# EAGLE design untitled (EAGLE 5.08)
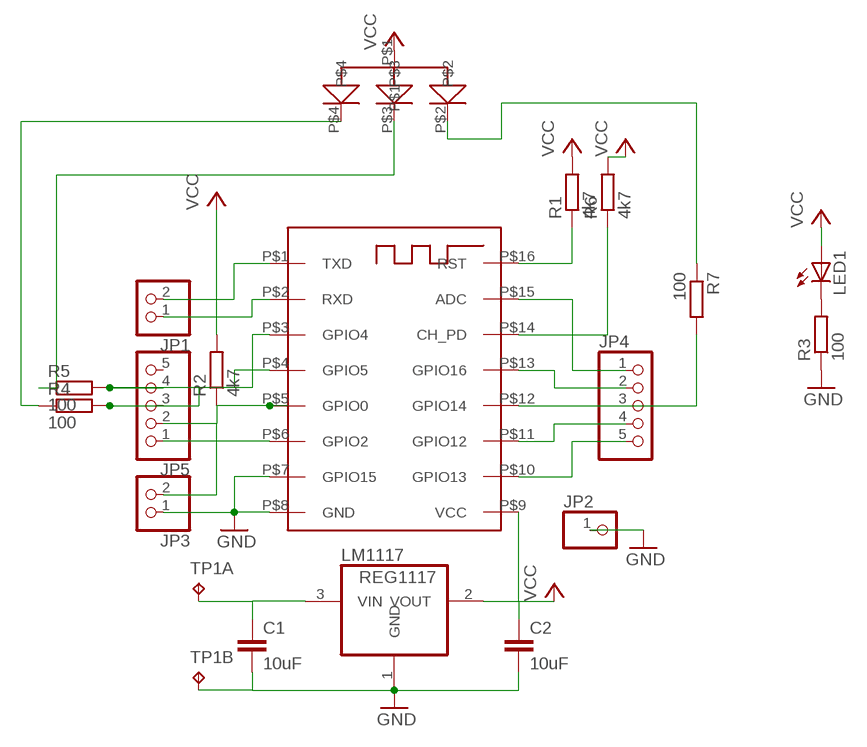
[diagram p0: schematic, sheet 1]

## Parts
C1  10uF  C-EUC0805K  [C0805K]
C2  10uF  C-EUC0805K  [C0805K]
ESP8266_07  ESP07  [ESP07]
JP1  PINHD-1X02_2.54-S  [1X02-S]
JP2  PINHD-1X1  [1X01]
JP3  PINHD-1X02_2.54-S  [1X02-S]
JP4  PINHD-1X05_2.54-S  [1X05-S]
JP5  PINHD-1X05_2.54-S  [1X05-S]
LED1  LEDCHIPLED_1206  [CHIPLED_1206]
LM1117  REG1117  [SOT223]
R1  4k7  R-EU_R0805  [R0805]
R2  4k7  R-EU_R0805  [R0805]
R3  100  R-EU_R0805  [R0805]
R4  100  R-EU_R0805  [R0805]
R5  100  R-EU_R0805  [R0805]
R6  4k7  R-EU_R0805  [R0805]
R7  100  R-EU_R0805  [R0805]
TP1  TP2P2-38-20  [P2-38-20]
U$1  LED  [LED]

## Nets
GND: C1.2 C2.2 ESP8266_07.P$7(GPIO15) ESP8266_07.P$8(GND) JP2.1 JP3.1 LM1117.1(GND) R3.1 TP1.TP-2
N$1: C1.1 LM1117.3(VIN) TP1.TP-1
N$2: ESP8266_07.P$14(CH_PD) R6.1
N$3: ESP8266_07.P$16(RST) R1.1
N$4: LED1.C R3.2
N$6: ESP8266_07.P$5(GPIO0) JP3.2 JP5.2 R2.1
N$7: ESP8266_07.P$1(TXD) JP1.2
N$8: R5.1 U$1.P$3
N$9: ESP8266_07.P$15(ADC) JP4.1
N$10: ESP8266_07.P$13(GPIO16) JP4.2
N$11: ESP8266_07.P$12(GPIO14) JP4.3 R7.2
N$12: ESP8266_07.P$11(GPIO12) JP4.4
N$13: ESP8266_07.P$10(GPIO13) JP4.5
N$14: ESP8266_07.P$2(RXD) JP1.1
N$15: ESP8266_07.P$6(GPIO2) JP5.1
N$16: ESP8266_07.P$4(GPIO5) JP5.3 R4.2
N$17: ESP8266_07.P$3(GPIO4) JP5.4 R5.2
N$18: R7.1 U$1.P$2
N$21: R4.1 U$1.P$4
VCC: C2.1 ESP8266_07.P$9(VCC) LED1.A LM1117.2(VOUT) R1.2 R2.2 R6.2 U$1.P$1
Unconnected: JP5.5

## Library data of the parts
C1 C2 = rcl:C-EU: CAPACITOR, European symbol
ESP8266_07 = connectors:ESP07
JP1 JP3 = pinhead-2:PINHD-1X02: PIN HEADER
JP2 = pinhead:PINHD-1X1: PIN HEADER
JP4 JP5 = pinhead-2:PINHD-1X05: PIN HEADER
LED1 = led:LED: LED OSRAM: - CHIPLED LG R971, LG N971, LY N971, LG Q971, LY Q971, LO R971, LY R971 LH N974, LH R974 LS Q976, LO Q976, LY Q976 LO Q996 - Hyper CHIPLED LW Q18S LB Q993, LB Q99A, LB R99A - SideLED LS A670, LO A670, LY A670, LG A670, LP A670 LB A673, LV A673, LT A673, LW A673 LH A674 LY A675 LS A676, LA A676, LO A676, LY A676, LW A676 LS A679, LY A679, LG A679 - Hyper Micro SIDELED® LS Y876, LA Y876, LO Y876, LY Y876 LT Y87S - SmartLED LW L88C, LW L88S LB L89C, LB L89S, LG L890 LS L89K, LO L89K, LY L89K LS L896, LA L896, LO L896, LY L896 - TOPLED LS T670, LO T670, LY T670, LG T670, LP T670 LSG T670, LSP T670, LSY T670, LOP T670, LYG T670 LG T671, LOG T671, LSG T671 LB T673, LV T673, LT T673, LW T673 LH T674 LS T676, LA T676, LO T676, LY T676, LB T676, LH T676, LSB T676, LW T676 LB T67C, LV T67C, LT T67C, LS T67K, LO T67K, LY T67K, LW E67C LS E67B, LA E67B, LO E67B, LY E67B, LB E67C, LV E67C, LT E67C LW T67C LS T679, LY T679, LG T679 LS T770, LO T770, LY T770, LG T770, LP T770 LB T773, LV T773, LT T773, LW T773 LH T774 LS E675, LA E675, LY E675, LS T675 LS T776, LA T776, LO T776, LY T776, LB T776 LHGB T686 LT T68C, LB T68C - Hyper Mini TOPLED® LB M676 - Mini TOPLED Santana® LG M470 LS M47K, LO M47K, LY M47K Source: http://www.osram.convergy.de LUXEON: - LUMILED® LXK2-PW12-R00, LXK2-PW12-S00, LXK2-PW14-U00, LXK2-PW14-V00 LXK2-PM12-R00, LXK2-PM12-S00, LXK2-PM14-U00 LXK2-PE12-Q00, LXK2-PE12-R00, LXK2-PE12-S00, LXK2-PE14-T00, LXK2-PE14-U00 LXK2-PB12-K00, LXK2-PB12-L00, LXK2-PB12-M00, LXK2-PB14-N00, LXK2-PB14-P00, LXK2-PB14-Q00 LXK2-PR12-L00, LXK2-PR12-M00, LXK2-PR14-Q00, LXK2-PR14-R00 LXK2-PD12-Q00, LXK2-PD12-R00, LXK2-PD12-S00 LXK2-PH12-R00, LXK2-PH12-S00 LXK2-PL12-P00, LXK2-PL12-Q00, LXK2-PL12-R00 Source: www.luxeon.com KINGBRIGHT: KA-3528ASYC Source: www.kingbright.com
LM1117 = burr-brown:REG1117: 800mA and 1A Low Dropout (LDO) Positive Regulator 1.8V, 2.5V, 2.85V, 3.3V, 5V, and Adj
R1-R7 = resistor:R-EU_: RESISTOR, European symbol
TP1 = testpad:TP2: Test pad
U$1 = connectors:LED

## Board
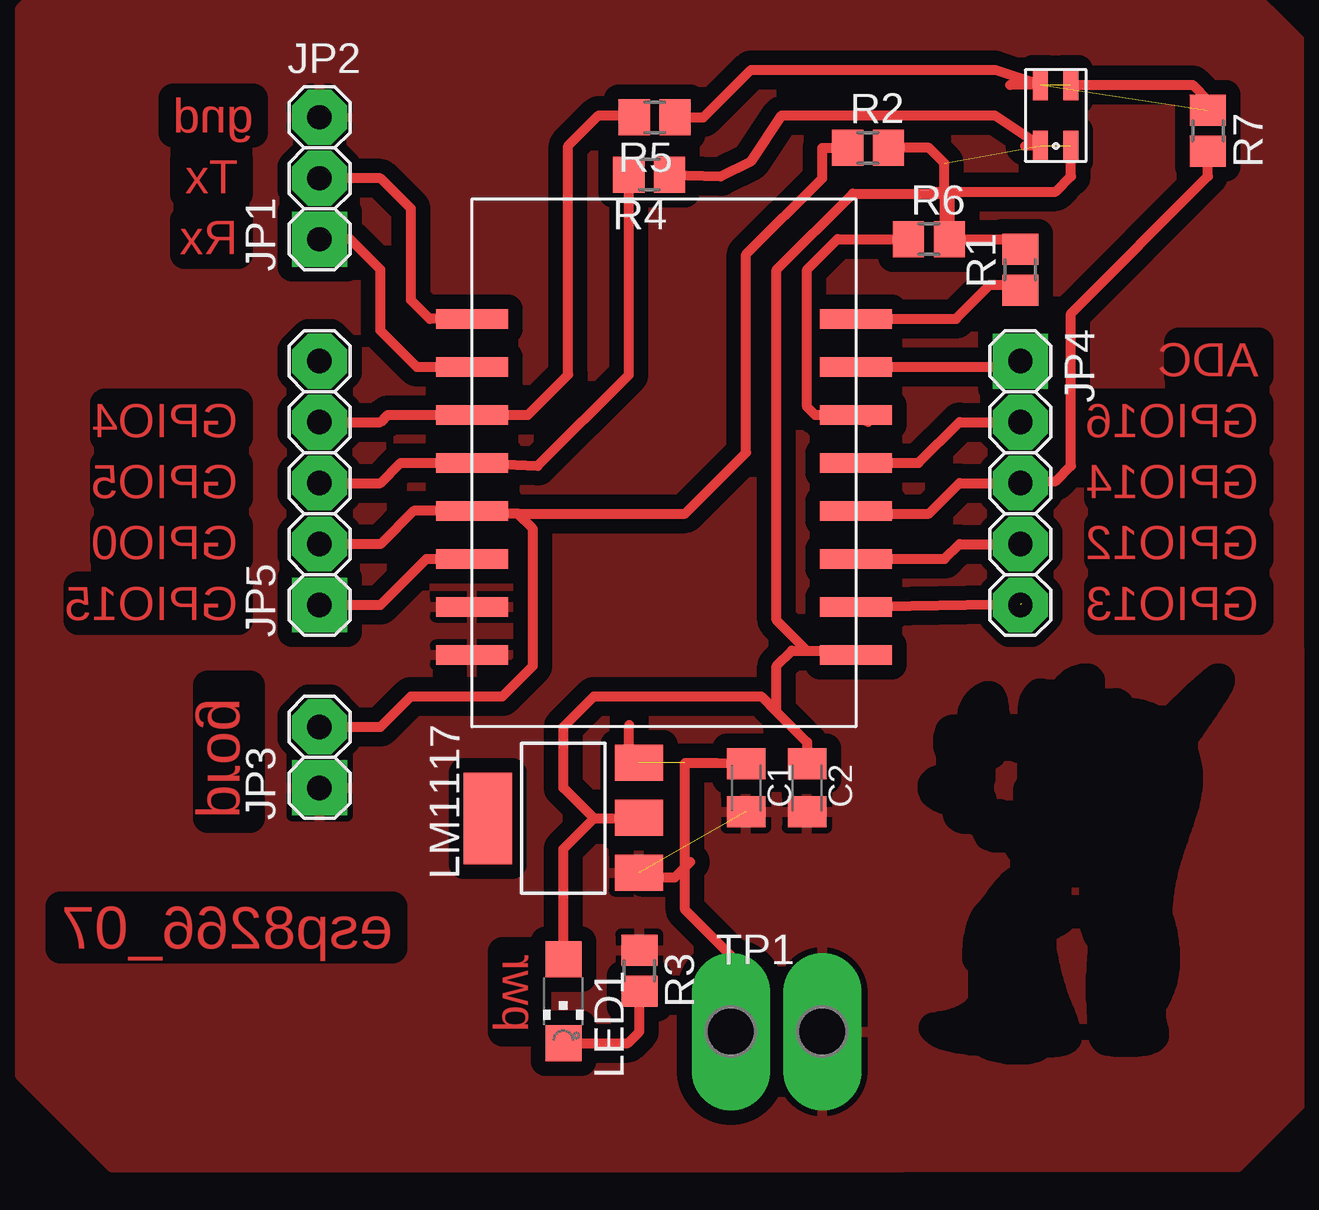
[diagram p1: board, top side]

No outline drawn. Coordinates in mm, seen from the top.
Copper layers (1*16): Top 0.018mm / dielectric 1mm / Bottom 0.018mm
Design rules "default": minimum track width 0.15mm, minimum drill 0.3mm, track to track 0.16mm, track to pad 0.16mm, pad to pad 0.16mm, via to via 0.16mm, smd to smd 0.16mm, copper to edge 0.25mm, drill to drill 0.25mm, minimum pad ring 25mil, minimum via ring 12mil, stop-mask expansion 4mil, vias tented up to drill 0mil, thermal gap 10mil
bKeepout: area 46.4,9.1 to 46.5,9.1; area 41.4,10.5 to 41.5,10.6
tRestrict: area 39.9,4.9 to 40.7,4.9; area 39.8,4.9 to 40.8,4.9; area 39.7,4.9 to 41,5; area 39.5,5 to 40.1,5; area 40.6,5 to 41.1,5; area 39.5,5 to 39.8,5; area 40.8,5 to 41.1,5; area 39.4,5 to 39.7,5; area 40.9,5 to 41.1,5; area 39.3,5 to 39.6,5.1; area 41,5 to 41.2,5.1; area 39.2,5.1 to 39.4,5.1; 5659 more areas
bRestrict: area 45.5,5.3 to 45.9,5.3

### Footprints (pad centres in the part's own frame; a part is rotated, then mirrored left to right if it is on the bottom)
C0805K = smd 1.3 x 1.6: 1 -1,0; 2 1,0
ESP07 = smd 3 x 0.8: P$1 0,17; P$2 0,15; P$3 0,13; P$4 0,11; P$5 0,9; P$6 0,7; P$7 0,5; P$8 0,3; P$9 16,3; P$10 16,5; P$11 16,7; P$12 16,9; P$13 16,11; P$14 16,13; P$15 16,15; P$16 16,17
1X02-S = drill 1.016 square: 1 -1.27,0 | drill 1.016 octagon: 2 1.27,0
1X01 = drill 1.016 octagon: 1 0,0
1X05-S = drill 1.016 square: 1 -5.08,0 | drill 1.016 octagon: 2 -2.54,0; 3 0,0; 4 2.54,0; 5 5.08,0
CHIPLED_1206 = smd 1.5 x 1.5: A 0,-1.75; C 0,1.75
SOT223 = smd 1.499 x 2.007: 1 -2.261,-3.15; 2 0.025,-3.15; 3 2.311,-3.15 | smd 3.81 x 2.007: 4 0,3.15
R0805 = smd 1.3 x 1.5: 1 -0.85,0; 2 0.85,0
P2-38-20 = drill 2.007 pad 2.54 long: TP-1 -1.905,0; TP-2 1.905,0
LED = smd 1.27 x 0.635: P$1 0.635,1.905; P$2 3.175,1.905; P$3 3.175,0.635; P$4 0.635,0.635

### Placement (x,y rotation side)
C1  29.01,15.8 270 top
C2  31.55,15.8 270 top
ESP8266_07  17.58,18.34 0 top
JP1  11.23,39.93 90 top
JP2  11.23,43.74 0 top
JP3  11.23,17.07 90 top
JP4  40.44,28.5 270 top
JP5  11.23,28.5 90 top
LED1  21.39,6.91 180 top
LM1117  21.39,14.53 90 top
R1  40.44,37.39 90 top
R2  34.09,42.47 0 top
R3  24.56,8.18 270 top
R4  24.97,41.35 180 top
R5  25.2,43.74 180 top
R6  36.63,38.66 0 top
R7  48.26,43.18 270 top
TP1  30.28,5.64 0 top
U$1  43.18,41.91 90 top

### Tracks (layer width: path | path; a pad name or v marks a point on that pad's centre or on a via)
GND  (1 unrouted)
  Top 0.406: LM1117.1 24.56,12.24
  pour Top (isolate 0.61): -1.27,3.81 2.54,0 35.56,0 35.56,19.05 38.1,21.59 52.07,21.59 52.07,46.99 49.53,49.53 0,49.53 -1.27,48.26
N$1  (1 unrouted)
  Top 0.406: C1.1 27.78,16.84 26.47,16.84 26.47,10.72 28.37,8.81 TP1.TP-1
N$2
  Top 0.406: 34.09,31.04 33.79,31.34 ESP8266_07.P$14 31.88,31.34 31.55,31.67 31.55,37.39 32.82,38.66 R6.1
N$3
  Top 0.406: ESP8266_07.P$16 37.75,35.34 39.17,36.75 40.22,36.75 R1.1
N$4
  Top 0.406: LED1.C 24.08,5.16 24.56,5.64 R3.2
N$5
  Top 0.406: 24.13,16.51 24.13,18.41
N$6
  Top 0.406: JP5.2 13.77,25.96 15.15,27.34 ESP8266_07.P$5 17.69,27.23 19.48,27.23 | JP3.2 13.77,18.34 15.04,19.61 18.85,19.61 20.12,20.88 20.12,26.59 19.48,27.23 | R2.1 32.18,42.47 32.18,41.2 29.01,38.02 29.01,29.77 26.47,27.23 19.48,27.23
N$7
  Top 0.406: ESP8266_07.P$1 15.82,35.34 15.04,36.12 15.04,39.93 13.77,41.2 JP1.2
N$8  (1 unrouted)
  Top 0.406: 48.26,43.81 48.26,44.45 47.62,45.09 U$1.P$3 | R5.1 27.23,43.74 29.21,45.72 39.37,45.72 41.27,45.09 40.01,45.09
N$9
  Top 0.406: ESP8266_07.P$15 40.2,33.34 JP4.1
N$10
  Top 0.406: ESP8266_07.P$13 36.2,29.34 37.9,31.04 JP4.2
N$11
  Top 0.15: ESP8266_07.P$12 34.09,27.23
  Top 0.406: 34.09,27.23 36.63,27.23 37.9,28.5 JP4.3 40.51,28.57 41.91,28.57 42.55,29.21 42.55,35.56 48.26,41.27 R7.2
N$12
  Top 0.406: ESP8266_07.P$11 37.28,25.34 37.9,25.96 JP4.4
N$13  (1 unrouted)
  Top 0.406: ESP8266_07.P$10 40.48,23.47
N$14
  Top 0.406: ESP8266_07.P$2 15.28,33.34 13.77,34.85 13.77,37.39 12.5,38.66 JP1.1
N$15
  Top 0.406: ESP8266_07.P$6 15.69,25.34 13.77,23.42 JP5.1
N$16
  Top 0.406: JP5.3 13.77,28.5 14.61,29.34 ESP8266_07.P$4 20.32,29.21 24.12,33.01 R4.2
N$17
  Top 0.406: JP5.4 13.77,31.04 14.07,31.34 ESP8266_07.P$3 19.91,31.34 21.59,33.02 21.59,42.55 22.86,43.81 24.27,43.81 R5.2
N$18  (1 unrouted)
N$19
  pour Top (isolate 0.61): 35.56,0 35.56,19.05 38.1,21.59 52.07,21.59 52.07,2.54 49.53,0
N$20
  Top 0.406: 24.77,12.06 26.04,12.06 26.67,12.7
N$21  (1 unrouted)
  Top 0.406: 36.83,40.64 41.91,40.64 42.55,41.27 U$1.P$4 | R4.1 27.94,41.27 29.21,41.91 30.48,43.81 39.37,43.81 41.27,42.55 40.64,42.55
VCC  (1 unrouted)
  Top 0.406: R2.2 36.63,42.47 37.26,41.83 37.26,40.56 | 37.26,40.56 37.26,38.87 R6.2 | R6.2 39.8,38.66 40.22,38.24 R1.2 | R6.2 37.48,40.35 37.26,40.56 | 37.26,40.56 33.45,40.56 30.28,37.39 30.28,22.78 31.55,21.51 | 31.55,21.51 33.4,21.51 ESP8266_07.P$9 | C2.1 31.55,17.7 30.28,18.97 | 30.28,18.97 29.64,19.61 22.66,19.61 21.39,18.34 21.39,15.8 22.66,14.53 | 22.66,14.53 24.51,14.53 LM1117.2 | LED1.A 21.39,13.26 22.66,14.53 | 31.55,21.51 30.91,21.51 30.28,20.88 30.28,18.97

### Text on the board
Top: gnd | gnd | Tx | Rx | ADC | GPIO4 | GPIO16 | GPIO5 | GPIO14 | GPIO0 | GPIO12 | GPIO15 | GPIO13 | prog | esp8266_07 | pwr